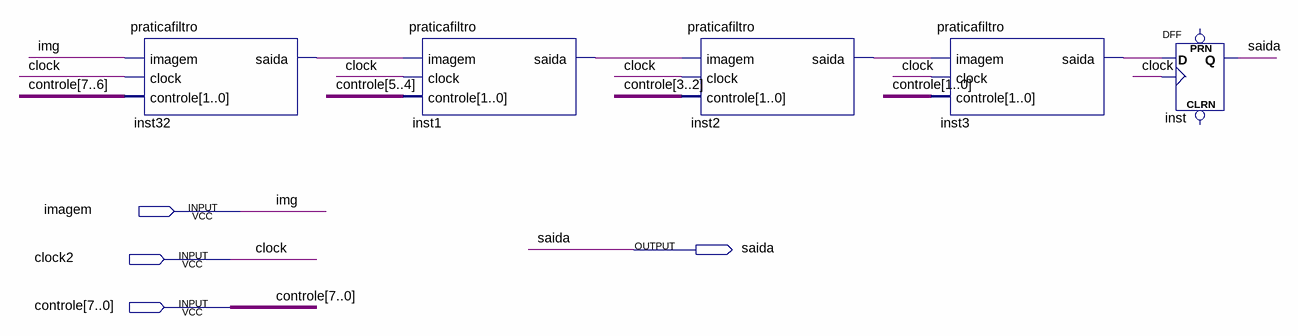
[diagram p0: schematic sheet]
// Quartus schematic filtro_pipe.bdf as structural Verilog: 5 symbols, 4 pins
module filtro_pipe (
  input  imagem,
  input  clock2,
  input  [7:0] controle,
  output saida
);

  wire inst1_saida, inst2_saida, inst3_saida, inst32_saida;

  praticafiltro inst32 (.imagem(imagem), .clock(clock2), .controle(controle[7:6]), .saida(inst32_saida));
  praticafiltro inst1 (.imagem(inst32_saida), .clock(clock2), .controle(controle[5:4]), .saida(inst1_saida));
  praticafiltro inst2 (.imagem(inst1_saida), .clock(clock2), .controle(controle[3:2]), .saida(inst2_saida));
  praticafiltro inst3 (.imagem(inst2_saida), .clock(clock2), .controle(controle[1:0]), .saida(inst3_saida));
  DFF inst (.CLK(clock2), .D(inst3_saida), .Q(saida));  // open: CLRN, PRN

  // Other names for the same wires on the sheet: clock = clock2; img = imagem
endmodule
